# Altium schematic sheet DIO_Sheet1.SchDoc
size A3; SheetNumber: 1; SheetTotal: 1
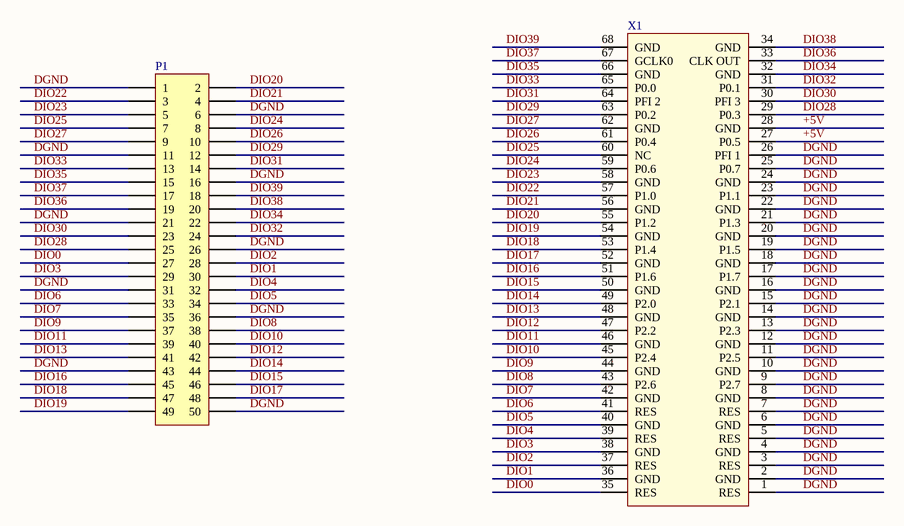
[diagram p0: DIO_Sheet1.SchDoc]

## Parts
P1  Header 25X2  [HDR2X25]  (value not drawn)
X1  FPGA_Connector  [FPGA]  (value not drawn)

## Nets
+5V: X1.27(P0.5) X1.28(GND)
DGND: P1.1 P1.6 P1.11 P1.16 P1.21 P1.26 P1.31 P1.36 P1.43 P1.50 X1.1(RES) X1.2(GND) X1.3(RES) X1.4(GND) X1.5(RES) X1.6(GND) X1.7(RES) X1.8(GND) X1.9(P2.7) X1.10(GND) X1.11(P2.5) X1.12(GND) X1.13(P2.3) X1.14(GND) X1.15(P2.1) X1.16(GND) X1.17(P1.7) X1.18(GND) X1.19(P1.5) X1.20(GND) X1.21(P1.3) X1.22(GND) X1.23(P1.1) X1.24(GND) X1.25(P0.7) X1.26(PFI_1)
DIO0: P1.27 X1.35(RES)
DIO1: P1.30 X1.36(GND)
DIO2: P1.28 X1.37(RES)
DIO3: P1.29 X1.38(GND)
DIO4: P1.32 X1.39(RES)
DIO5: P1.34 X1.40(GND)
DIO6: P1.33 X1.41(RES)
DIO7: P1.35 X1.42(GND)
DIO8: P1.38 X1.43(P2.6)
DIO9: P1.37 X1.44(GND)
DIO10: P1.40 X1.45(P2.4)
DIO11: P1.39 X1.46(GND)
DIO12: P1.42 X1.47(P2.2)
DIO13: P1.41 X1.48(GND)
DIO14: P1.44 X1.49(P2.0)
DIO15: P1.46 X1.50(GND)
DIO16: P1.45 X1.51(P1.6)
DIO17: P1.48 X1.52(GND)
DIO18: P1.47 X1.53(P1.4)
DIO19: P1.49 X1.54(GND)
DIO20: P1.2 X1.55(P1.2)
DIO21: P1.4 X1.56(GND)
DIO22: P1.3 X1.57(P1.0)
DIO23: P1.5 X1.58(GND)
DIO24: P1.8 X1.59(P0.6)
DIO25: P1.7 X1.60(NC)
DIO26: P1.10 X1.61(P0.4)
DIO27: P1.9 X1.62(GND)
DIO28: P1.25 X1.29(P0.3)
DIO29: P1.12 X1.63(P0.2)
DIO30: P1.23 X1.30(PFI_3)
DIO31: P1.14 X1.64(PFI_2)
DIO32: P1.24 X1.31(P0.1)
DIO33: P1.13 X1.65(P0.0)
DIO34: P1.22 X1.32(GND)
DIO35: P1.15 X1.66(GND)
DIO36: P1.19 X1.33(CLK_OUT)
DIO37: P1.17 X1.67(GCLK0)
DIO38: P1.20 X1.34(GND)
DIO39: P1.18 X1.68(GND)

## Library data of the parts
P1 = Header 25X2: Header, 25-Pin, Dual row; LatestRevisionDate: 17-Jul-2002; LatestRevisionNote: Re-released for DXP Platform.; Publisher: Altium Limited